# EAGLE design Schematic (EAGLE 9.6.2)
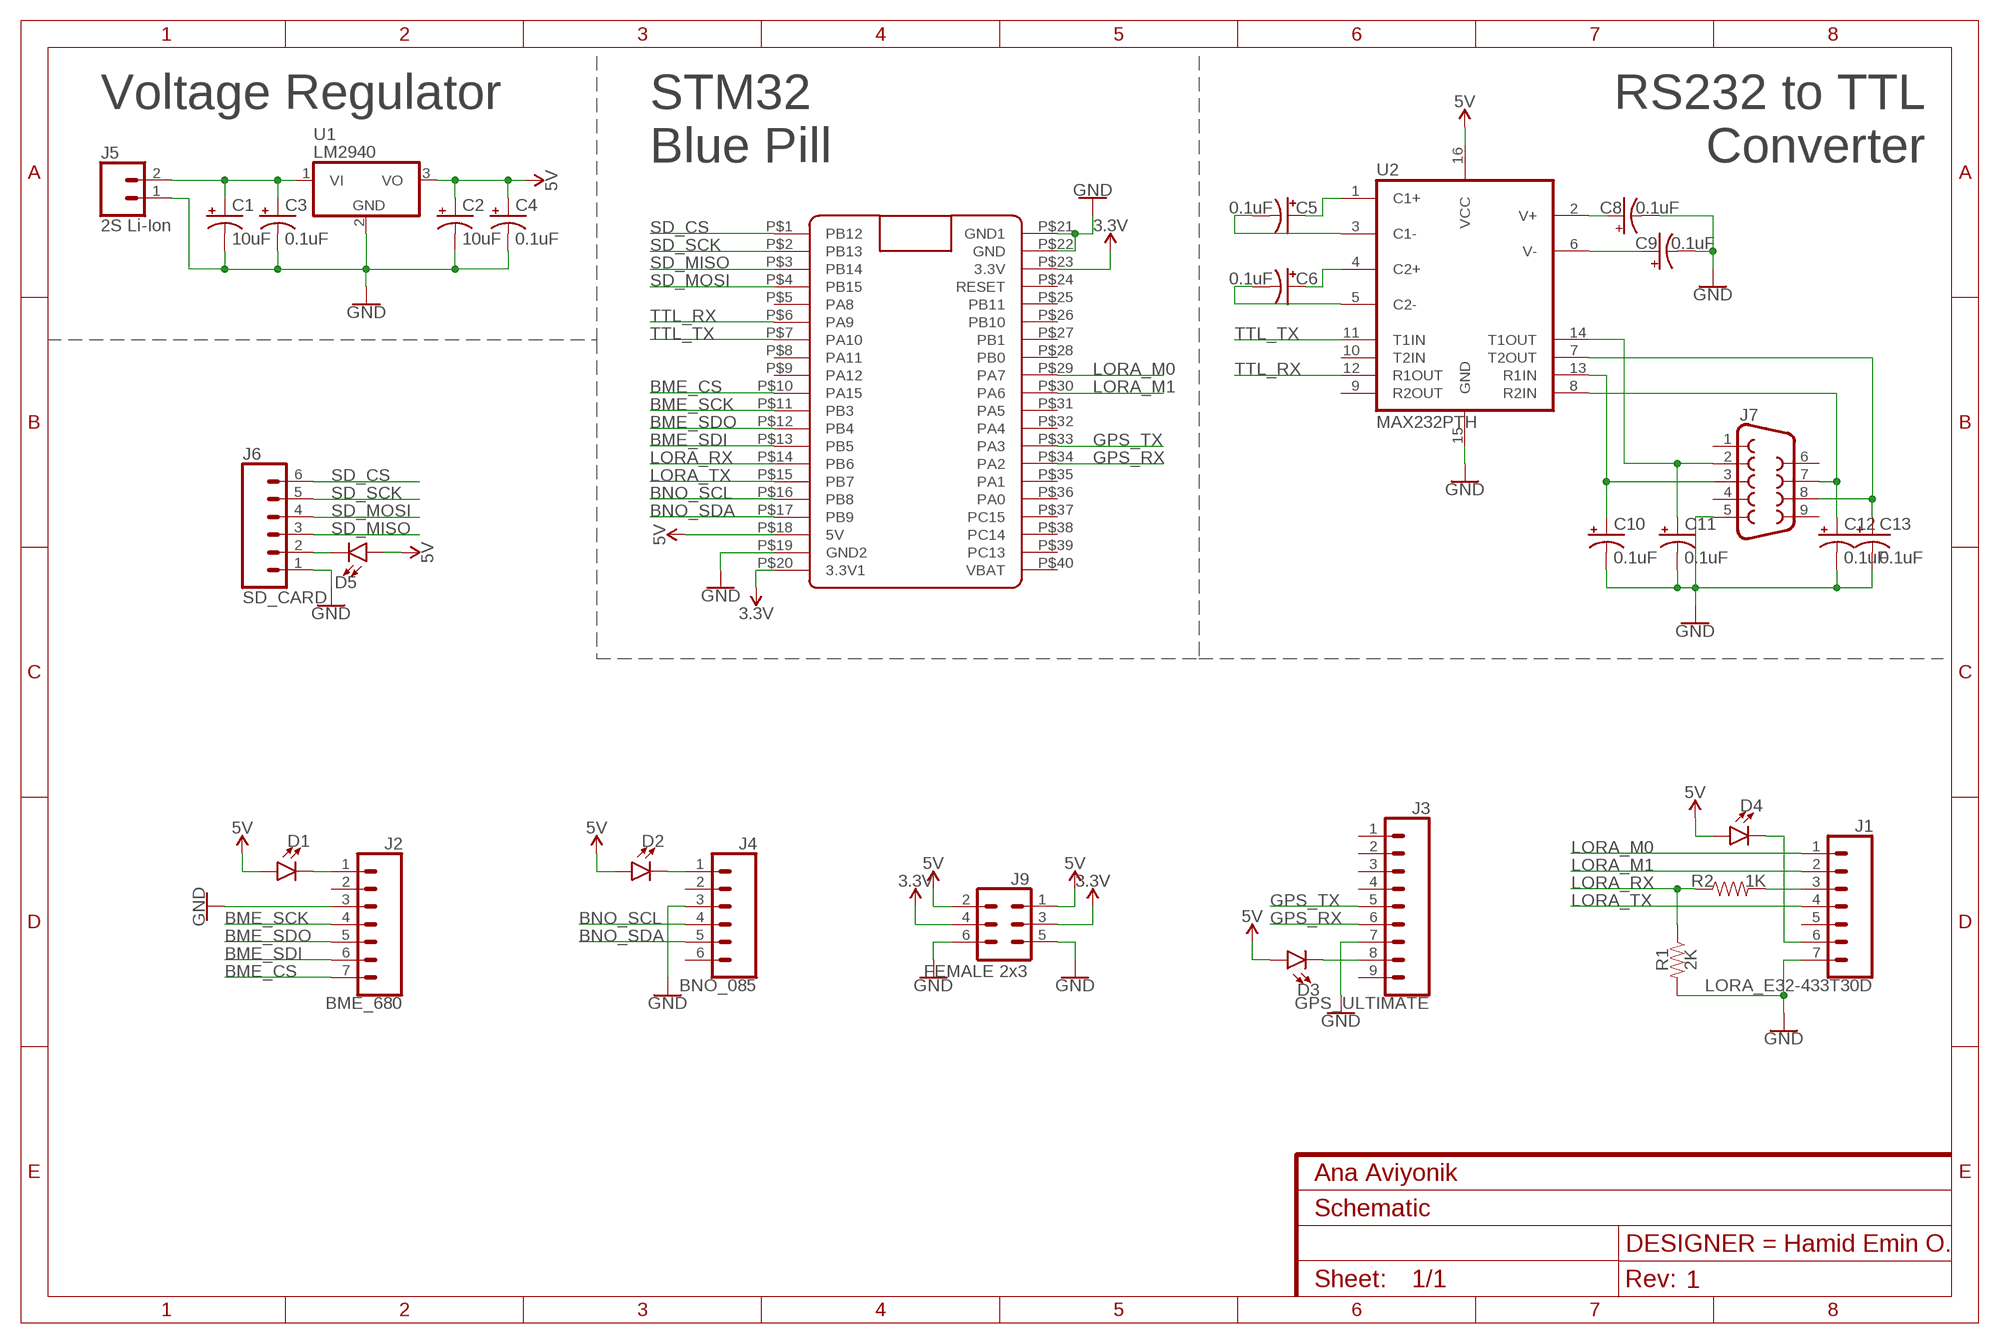
[diagram p0: schematic, sheet 1]
FRAME1 (FRAME-A4L): CNAME: Ana Aviyonik; CREVISION: 1; DESIGNER: Hamid Emin O.

## Parts
C1  10uF  10UF-POLAR-RADIAL-2.5MM-KIT-25V-20%  [CPOL-RADIAL-2.5MM-5MM-KIT]
C2  10uF  10UF-POLAR-RADIAL-2.5MM-KIT-25V-20%  [CPOL-RADIAL-2.5MM-5MM-KIT]
C3  0.1uF  10UF-POLAR-RADIAL-2.5MM-KIT-25V-20%  [CPOL-RADIAL-2.5MM-5MM-KIT]
C4  0.1uF  10UF-POLAR-RADIAL-2.5MM-KIT-25V-20%  [CPOL-RADIAL-2.5MM-5MM-KIT]
C5  0.1uF  10UF-POLAR-RADIAL-2.5MM-KIT-25V-20%  [CPOL-RADIAL-2.5MM-5MM-KIT]
C6  0.1uF  10UF-POLAR-RADIAL-2.5MM-KIT-25V-20%  [CPOL-RADIAL-2.5MM-5MM-KIT]
C8  0.1uF  10UF-POLAR-RADIAL-2.5MM-KIT-25V-20%  [CPOL-RADIAL-2.5MM-5MM-KIT]
C9  0.1uF  10UF-POLAR-RADIAL-2.5MM-KIT-25V-20%  [CPOL-RADIAL-2.5MM-5MM-KIT]
C10  0.1uF  10UF-POLAR-RADIAL-2.5MM-KIT-25V-20%  [CPOL-RADIAL-2.5MM-5MM-KIT]
C11  0.1uF  10UF-POLAR-RADIAL-2.5MM-KIT-25V-20%  [CPOL-RADIAL-2.5MM-5MM-KIT]
C12  0.1uF  10UF-POLAR-RADIAL-2.5MM-KIT-25V-20%  [CPOL-RADIAL-2.5MM-5MM-KIT]
C13  0.1uF  10UF-POLAR-RADIAL-2.5MM-KIT-25V-20%  [CPOL-RADIAL-2.5MM-5MM-KIT]
D1  LED-3MM-NO_SILK  [LED_3MM-NS]
D2  LED-3MM-NO_SILK  [LED_3MM-NS]
D3  LED-3MM-NO_SILK  [LED_3MM-NS]
D4  LED-3MM-NO_SILK  [LED_3MM-NS]
D5  LED-3MM-NO_SILK  [LED_3MM-NS]
J1  LORA_E32-433T30D  CONN_07  [1X07]
J2  BME_680  CONN_07  [1X07]
J3  GPS_ULTIMATE  CONN_09  [1X09]
J4  BNO_085  CONN_06SILK_FEMALE_PTH  [1X06]
J5  2S Li-Ion  CONN_02  [1X02]
J6  SD_CARD  CONN_06SILK_FEMALE_PTH  [1X06]
J7  DB9FEMALE  [DB9]
J9  FEMALE 2x3  CONN_03X2FEMALE  [2X3]
R1  2K  1KOHM-VERT_KIT-1/4W-5%  [AXIAL-0.1-KIT]
R2  1K  1KOHM-VERT_KIT-1/4W-5%  [AXIAL-0.1-KIT]
STM32BLUEPILL  STM32 Blue Pill  BLUE_PILL  [BLUE_PILL]
U1  LM2940  786TV  [TO220V]
U2  MAX232PTH  [DIL16]

## Nets
3.3V: J9.3 J9.4 STM32BLUEPILL.P$20(3.3V1) STM32BLUEPILL.P$23(3.3V)
5V: C2.1(+) C4.1(+) D1.A D2.A D3.A D4.A D5.A J9.1 J9.2 STM32BLUEPILL.P$18(5V) U1.3(VO) U2.16(VCC)
BME_CS: J2.7 STM32BLUEPILL.P$10(PA15)
BME_SCK: J2.4 STM32BLUEPILL.P$11(PB3)
BME_SDI: J2.6 STM32BLUEPILL.P$13(PB5)
BME_SDO: J2.5 STM32BLUEPILL.P$12(PB4)
BNO_SCL: J4.4 STM32BLUEPILL.P$16(PB8)
BNO_SDA: J4.5 STM32BLUEPILL.P$17(PB9)
GND: C1.2(-) C2.2(-) C3.2(-) C4.2(-) C8.2(-) C9.2(-) C10.2(-) C11.2(-) C12.2(-) C13.2(-) J1.7 J2.3 J3.7 J4.3 J5.1 J6.1 J7.5 J9.5 J9.6 R1.P$2 STM32BLUEPILL.P$19(GND2) STM32BLUEPILL.P$21(GND1) STM32BLUEPILL.P$22(GND) U1.2(GND) U2.15(GND)
GPS_RX: J3.6 STM32BLUEPILL.P$34(PA2)
GPS_TX: J3.5 STM32BLUEPILL.P$33(PA3)
LORA_M0: J1.1 STM32BLUEPILL.P$29(PA7)
LORA_M1: J1.2 STM32BLUEPILL.P$30(PA6)
LORA_RX: R1.P$1 R2.P$1 STM32BLUEPILL.P$14(PB6)
LORA_TX: J1.4 STM32BLUEPILL.P$15(PB7)
N$1: C1.1(+) C3.1(+) J5.2 U1.1(VI)
N$2: C8.1(+) U2.2(V+)
N$3: C9.1(+) U2.6(V-)
N$4: J1.3 R2.P$2
N$5: D1.K(C) J2.1
N$6: D2.K(C) J4.1
N$7: D3.K(C) J3.8
N$8: C6.1(+) U2.4(C2+)
N$9: C6.2(-) U2.5(C2-)
N$10: C5.1(+) U2.1(C1+)
N$11: C5.2(-) U2.3(C1-)
N$12: D4.K(C) J1.6
N$13: C13.1(+) J7.8 U2.7(T2OUT)
N$14: C12.1(+) J7.7 U2.8(R2IN)
N$15: C11.1(+) J7.2 U2.14(T1OUT)
N$16: C10.1(+) J7.3 U2.13(R1IN)
N$18: D5.K(C) J6.2
SD_CS: J6.6 STM32BLUEPILL.P$1(PB12)
SD_MISO: J6.3 STM32BLUEPILL.P$3(PB14)
SD_MOSI: J6.4 STM32BLUEPILL.P$4(PB15)
SD_SCK: J6.5 STM32BLUEPILL.P$2(PB13)
TTL_RX: STM32BLUEPILL.P$6(PA9) U2.12(R1OUT)
TTL_TX: STM32BLUEPILL.P$7(PA10) U2.11(T1IN)
Unconnected: J1.5 J2.2 J3.1 J3.2 J3.3 J3.4 J3.9 J4.2 J4.6 J7.1 J7.4 J7.6 J7.9 STM32BLUEPILL.P$5(PA8) STM32BLUEPILL.P$8(PA11) STM32BLUEPILL.P$9(PA12) STM32BLUEPILL.P$24(RESET) STM32BLUEPILL.P$25(PB11) STM32BLUEPILL.P$26(PB10) STM32BLUEPILL.P$27(PB1) STM32BLUEPILL.P$28(PB0) STM32BLUEPILL.P$31(PA5) STM32BLUEPILL.P$32(PA4) STM32BLUEPILL.P$35(PA1) STM32BLUEPILL.P$36(PA0) STM32BLUEPILL.P$37(PC15) STM32BLUEPILL.P$38(PC14) STM32BLUEPILL.P$39(PC13) STM32BLUEPILL.P$40(VBAT) U2.9(R2OUT) U2.10(T2IN)

## Notes on the sheet
- RS232 to TTL
  Converter
- Voltage Regulator
- STM32
  Blue Pill

## Library data of the parts
C1 C2 = SparkFun-Capacitors:10UF-POLAR: 10.0µF polarized capacitors A capacitor is a passive two-terminal electrical component used to store electrical energy temporarily in an electric field.; PROD_ID: CAP-08440
C3-C6 C8-C13 = SparkFun-Capacitors:10UF-POLAR: 10.0µF polarized capacitors A capacitor is a passive two-terminal electrical component used to store electrical energy temporarily in an electric field.; PROD_ID: CAP-08440; VALUE: 10uF
D1-D5 = SparkFun-LED:LED: LED (Generic) Standard schematic elements and footprints for 5mm, 3mm, 1206, and 0603 sized LEDs. Generic LEDs with no color specified.
J1 J2 = SparkFun-Connectors:CONN_07: Multi connection point. Often used as Generic Header-pin footprint for 0.1 inch spaced/style header connections On any of the 0.1 inch spaced packages, you can populate with these: Break Away Headers - Straight <https://www.sparkfun.com/products/116> (PRT-00116) Break Away Male Headers - Right Angle <https://www.sparkfun.com/products/553> (PRT-00553) Female Headers <https://www.sparkfun.com/products/115> (PRT-00115) Break Away Headers - Machine Pin <https://www.sparkfun.com/products/117> (PRT-00117) Break Away Female Headers - Swiss Machine Pin <https://www.sparkfun.com/products/743> (PRT-00743) For SCREWTERMINALS and SPRING TERMINALS visit here: Screw Terimnals on SparkFun.com <https://www.sparkfun.com/search/results?term=Screw+Terminals> (5mm/3.5mm/2.54mm spacing) This device is also useful as a general connection point to wire up your design to another part of your project. Our various solder wires solder well into these plated through hole pads. Hook-Up Wire - Assortment (Stranded, 22 AWG) <https://www.sparkfun.com/products/11375> (PRT-11375) Hook-Up Wire - Assortment (Solid Core, 22 AWG) <https://www.sparkfun.com/products/11367> (PRT-11367) View the entire wire category on our website here <https://www.sparkfun.com/categories/141> Special notes: Molex polarized connector foot print use with SKU : PRT-08231 with associated crimp pins and housings. 1MM SMD Version SKU: PRT-10208 NOTES ON THE VARIANTS LOCK and LOCK_LONGPADS... This footprint was designed to help hold the alignment of a through-hole component (i.e. 6-pin header) while soldering it into place. You may notice that each hole has been shifted either up or down by 0.005 of an inch from it's more standard position (which is a perfectly straight line). This slight alteration caused the pins (the squares in the middle) to touch the edges of the holes. Because they are alternating, it causes a "brace" to hold the component in place. 0.005 has proven to be the perfect amount of "off-center" position when using our standard breakaway headers. Although looks a little odd when you look at the bare footprint, once you have a header in there, the alteration is very hard to notice. Also,if you push a header all the way into place, it is covered up entirely on the bottom side.
J3 = SparkFun-Connectors:CONN_09: Multi connection point. Often used as Generic Header-pin footprint for 0.1 inch spaced/style header connections On any of the 0.1 inch spaced packages, you can populate with these: Break Away Headers - Straight <https://www.sparkfun.com/products/116> (PRT-00116) Break Away Male Headers - Right Angle <https://www.sparkfun.com/products/553> (PRT-00553) Female Headers <https://www.sparkfun.com/products/115> (PRT-00115) Break Away Headers - Machine Pin <https://www.sparkfun.com/products/117> (PRT-00117) Break Away Female Headers - Swiss Machine Pin <https://www.sparkfun.com/products/743> (PRT-00743) For SCREWTERMINALS and SPRING TERMINALS visit here: Screw Terimnals on SparkFun.com <https://www.sparkfun.com/search/results?term=Screw+Terminals> (5mm/3.5mm/2.54mm spacing) This device is also useful as a general connection point to wire up your design to another part of your project. Our various solder wires solder well into these plated through hole pads. Hook-Up Wire - Assortment (Stranded, 22 AWG) <https://www.sparkfun.com/products/11375> (PRT-11375) Hook-Up Wire - Assortment (Solid Core, 22 AWG) <https://www.sparkfun.com/products/11367> (PRT-11367) View the entire wire category on our website here <https://www.sparkfun.com/categories/141> Special notes: Molex polarized connector foot print use with SKU : PRT-08231 with associated crimp pins and housings. 1MM SMD Version SKU: PRT-10208 NOTES ON THE VARIANTS LOCK and LOCK_LONGPADS... This footprint was designed to help hold the alignment of a through-hole component (i.e. 6-pin header) while soldering it into place. You may notice that each hole has been shifted either up or down by 0.005 of an inch from it's more standard position (which is a perfectly straight line). This slight alteration caused the pins (the squares in the middle) to touch the edges of the holes. Because they are alternating, it causes a "brace" to hold the component in place. 0.005 has proven to be the perfect amount of "off-center" position when using our standard breakaway headers. Although looks a little odd when you look at the bare footprint, once you have a header in there, the alteration is very hard to notice. Also,if you push a header all the way into place, it is covered up entirely on the bottom side.
J4 J6 = SparkFun-Connectors:CONN_06: Multi connection point. Often used as Generic Header-pin footprint for 0.1 inch spaced/style header connections On any of the 0.1 inch spaced packages, you can populate with these: Break Away Headers - Straight <https://www.sparkfun.com/products/116> (PRT-00116) Break Away Male Headers - Right Angle <https://www.sparkfun.com/products/553> (PRT-00553) Female Headers <https://www.sparkfun.com/products/115> (PRT-00115) Break Away Headers - Machine Pin <https://www.sparkfun.com/products/117> (PRT-00117) Break Away Female Headers - Swiss Machine Pin <https://www.sparkfun.com/products/743> (PRT-00743) Arduino Stackable Header - 6 Pin <https://www.sparkfun.com/products/9280> (PRT-09280) Screw Terminals 2.54mm Pitch (6-Pin) <https://www.sparkfun.com/products/16499> (PRT-16499) For SCREWTERMINALS and SPRING TERMINALS visit here: Screw Terimnals on SparkFun.com <https://www.sparkfun.com/search/results?term=Screw+Terminals> (5mm/3.5mm/2.54mm spacing) This device is also useful as a general connection point to wire up your design to another part of your project. Our various solder wires solder well into these plated through hole pads. Hook-Up Wire - Assortment (Stranded, 22 AWG) <https://www.sparkfun.com/products/11375> (PRT-11375) Hook-Up Wire - Assortment (Solid Core, 22 AWG) <https://www.sparkfun.com/products/11367> (PRT-11367) View the entire wire category on our website here <https://www.sparkfun.com/categories/141>; PROD_ID: CONN-08437
J5 = SparkFun-Connectors:CONN_02: Multi connection point. Often used as Generic Header-pin footprint for 0.1 inch spaced/style header connections On any of the 0.1 inch spaced packages, you can populate with these: Break Away Headers - Straight <https://www.sparkfun.com/products/116> (PRT-00116) Break Away Male Headers - Right Angle <https://www.sparkfun.com/products/553> (PRT-00553) Female Headers <https://www.sparkfun.com/products/115> (PRT-00115) Break Away Headers - Machine Pin <https://www.sparkfun.com/products/117> (PRT-00117) Break Away Female Headers - Swiss Machine Pin <https://www.sparkfun.com/products/743> (PRT-00743) For SCREWTERMINALS and SPRING TERMINALS visit here: Screw Terimnals on SparkFun.com <https://www.sparkfun.com/search/results?term=Screw+Terminals> (5mm/3.5mm/2.54mm spacing) This device is also useful as a general connection point to wire up your design to another part of your project. Our various solder wires solder well into these plated through hole pads. Hook-Up Wire - Assortment (Stranded, 22 AWG) <https://www.sparkfun.com/products/11375> (PRT-11375) Hook-Up Wire - Assortment (Solid Core, 22 AWG) <https://www.sparkfun.com/products/11367> (PRT-11367) View the entire wire category on our website here <https://www.sparkfun.com/categories/141> Special notes: Molex polarized connector foot print use with: PRT-08233 with associated crimp pins and housings. 2.54_SCREWTERM for use with PRT-10571. 3.5mm Screw Terminal footprints for PRT-08084 5mm Screw Terminal footprints for use with PRT-08432
J7 = SparkFun-Connectors:DB9: DB9 Connector Standard DB9 (D-Sub 9) serial connector. Can be used for CAN bus as well as RS485 and RS232. Footprint production proven. Here is the female version connector we sell at SparkFun: 9 Pin Female Serial Connector - PCB Mount <https://www.sparkfun.com/products/429> (PRT-00429) This connector has been used on the following SparkFun products: SparkFun RS232 Shifter - SMD <https://www.sparkfun.com/products/449> (PRT-00449) SparkFun RS232 Shifter SMD (No DB9) <https://www.sparkfun.com/products/8780> (PRT-08780); PROD_ID: CONN-08194
J9 = SparkFun-Connectors:CONN_03X2: Multi connection point. Often used as Generic Header-pin footprint for 0.1 inch spaced/style header connections You can populate with any combo of single row headers, but if you'd like an exact match, check these: Header - 2x3 (Male, 0.1") <https://www.sparkfun.com/products/12807> (PRT-12807) Header - 2x3 (Female, 0.1") <https://www.sparkfun.com/products/13010> (PRT-13010) 2x3 Pin Shrouded Header <https://www.sparkfun.com/products/10877> (PRT-10877) On any of the 0.1 inch spaced packages, you can populate with these: Break Away Headers - Straight <https://www.sparkfun.com/products/116> (PRT-00116) Break Away Male Headers - Right Angle <https://www.sparkfun.com/products/553> (PRT-00553) Female Headers <https://www.sparkfun.com/products/115> (PRT-00115) Break Away Headers - Machine Pin <https://www.sparkfun.com/products/117> (PRT-00117) Break Away Female Headers - Swiss Machine Pin <https://www.sparkfun.com/products/743> (PRT-00743) Special note: the shrouded connector mates well with our 3x2 ribbon cables: Ribbon Crimp Connector - 6-pin (2x3, Female) <https://www.sparkfun.com/products/10651> (PRT-10651) Ribbon Cable - 6 wire (15ft) <https://www.sparkfun.com/products/10646> (PRT-10646); PROD_ID: CONN-11566
R1 R2 = SparkFun-Resistors:1KOHM: 1kΩ resistor A resistor is a passive two-terminal electrical component that implements electrical resistance as a circuit element. Resistors act to reduce current flow, and, at the same time, act to lower voltage levels within circuits. - Wikipedia; PROD_ID: RES-08380; VALUE: 1k
STM32BLUEPILL = BluePill:BLUE_PILL
U1 = linear:78*: Positive VOLTAGE REGULATOR Source: http://cache.national.com/ds/LM/LM78L05.pdf http://www.fairchildsemi.com/ds/LM/LM7805.pdf
U2 = MAXIM:MAX232: RS232 Transceiver Very common IC. This is generically called 'MAX232', but works with the 3V equivalent MAX3232 generic ICs. Field tested and mother approved. Spark Fun Electronics SKU : COM-00316 (DIP) and COM-00589 (SMD)

## Board
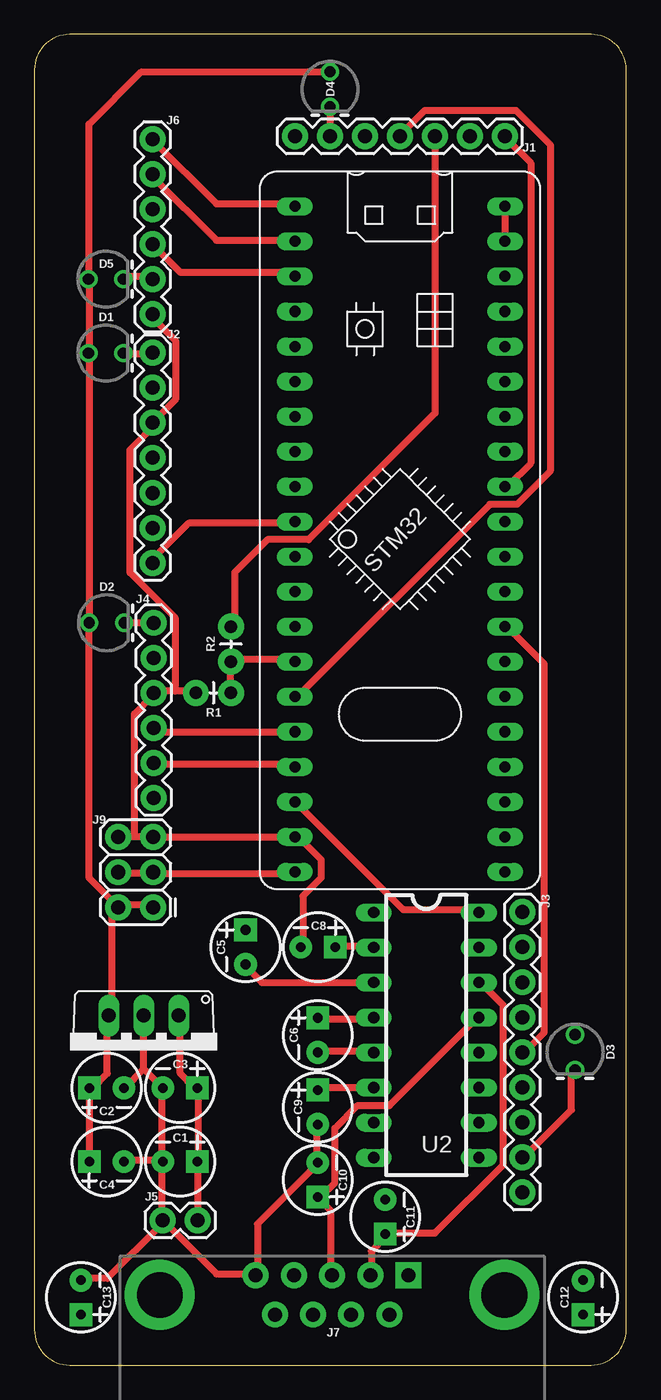
[diagram p1: board, top side]
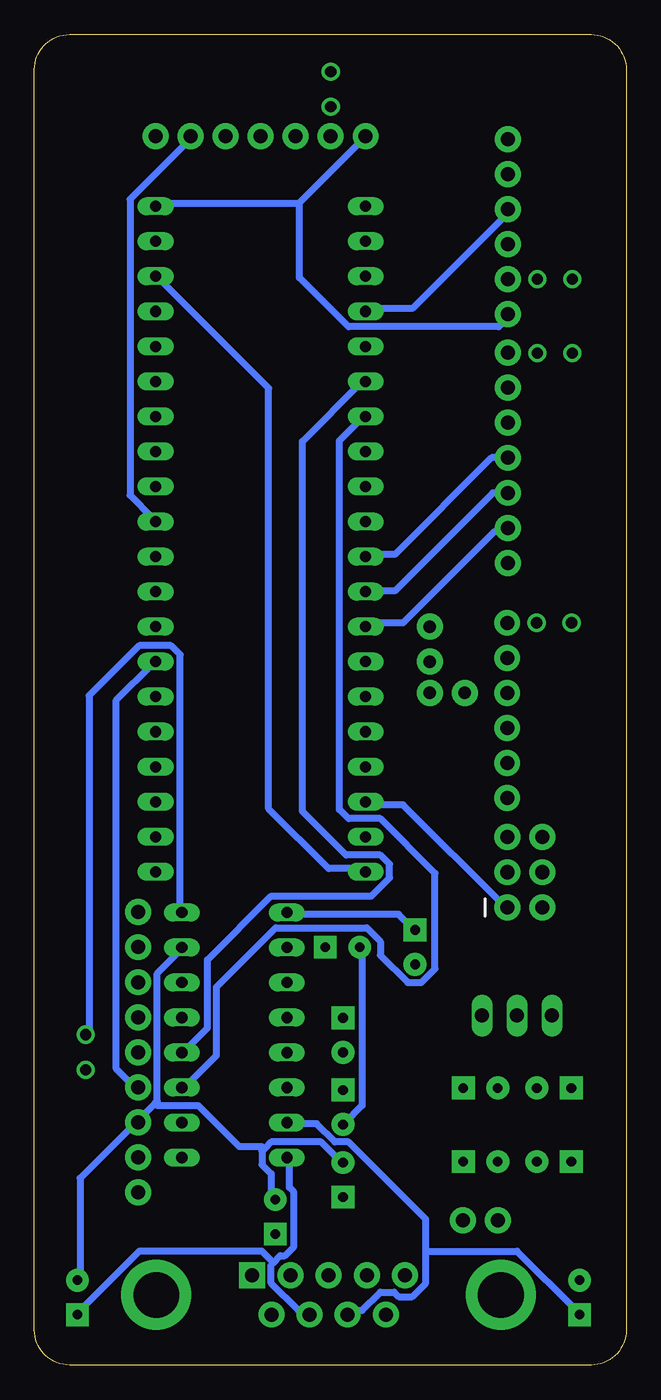
[diagram p2: board, bottom side, seen from below]

Size 42.93 x 96.48 mm. Coordinates in mm from the lower left corner, seen from the top.
Outline: 0,93.94 0,2.54 arc90 2.54,0 40.39,0 arc90 42.93,2.54 42.93,93.94 arc90 40.39,96.48 2.54,96.48 arc90 0,93.94
Copper layers (1*16): Top 0.035mm / dielectric 1.5mm / Bottom 0.035mm
Design rules "default *": minimum track width 20mil, minimum drill 0.35mm, track to track 6mil, track to pad 6mil, pad to pad 6mil, via to via 6mil, smd to smd 6mil, copper to edge 40mil, drill to drill 6mil, minimum pad ring 10mil, minimum via ring 8mil, stop-mask expansion 4mil, vias tented up to drill 0mil, thermal gap 10mil

### Footprints (pad centres in the part's own frame; a part is rotated, then mirrored left to right if it is on the bottom)
CPOL-RADIAL-2.5MM-5MM-KIT = drill 0.7 pad 1.651 square: 1 1.25,0 | drill 0.7 pad 1.651: 2 -1.25,0
LED_3MM-NS = drill 0.813: A -1.27,0; K 1.27,0
1X07 = drill 1.016 pad 1.88: 1 0,0; 2 2.54,0; 3 5.08,0; 4 7.62,0; 5 10.16,0; 6 12.7,0; 7 15.24,0
1X09 = drill 1.016 pad 1.88: 1 0,0; 2 2.54,0; 3 5.08,0; 4 7.62,0; 5 10.16,0; 6 12.7,0; 7 15.24,0; 8 17.78,0; 9 20.32,0
1X06 = drill 1.016 pad 1.88: 1 0,0; 2 2.54,0; 3 5.08,0; 4 7.62,0; 5 10.16,0; 6 12.7,0
1X02 = drill 1.016 pad 1.88: 1 0,0; 2 2.54,0
DB9 = drill 1.016 pad 1.88 square: 1 -5.54,-1.42 | drill 1.016 pad 1.88: 2 -2.77,-1.42; 3 0,-1.42; 4 2.77,-1.42; 5 5.54,-1.42; 6 -4.15,1.42; 7 -1.38,1.42; 8 1.38,1.42; 9 4.15,1.42 | drill 3.302 pad 5.08: G1 -12.5,0; G2 12.5,0
2X3 = drill 1.016 pad 1.88: 1 0,0; 2 0,2.54; 3 2.54,0; 4 2.54,2.54; 5 5.08,0; 6 5.08,2.54
AXIAL-0.1-KIT = drill 0.9 pad 1.88: P$1 -1.27,0; P$2 1.27,0
BLUE_PILL = drill 0.8 long: P$1 -7.62,15.24; P$2 -7.62,12.7; P$3 -7.62,10.16; P$4 -7.62,7.62; P$5 -7.62,5.08; P$6 -7.62,2.54; P$7 -7.62,0; P$8 -7.62,-2.54; P$9 -7.62,-5.08; P$10 -7.62,-7.62; P$11 -7.62,-10.16; P$12 -7.62,-12.7; P$13 -7.62,-15.24; P$14 -7.62,-17.78; P$15 -7.62,-20.32; P$16 -7.62,-22.86; P$17 -7.62,-25.4; P$18 -7.62,-27.94; P$19 -7.62,-30.48; P$20 -7.62,-33.02; P$21 7.62,15.24; P$22 7.62,12.7; P$23 7.62,10.16; P$24 7.62,7.62; P$25 7.62,5.08; P$26 7.62,2.54; P$27 7.62,0; P$28 7.62,-2.54; P$29 7.62,-5.08; P$30 7.62,-7.62; P$31 7.62,-10.16; P$32 7.62,-12.7; P$33 7.62,-15.24; P$34 7.62,-17.78; P$35 7.62,-20.32; P$36 7.62,-22.86; P$37 7.62,-25.4; P$38 7.62,-27.94; P$39 7.62,-30.48; P$40 7.62,-33.02
TO220V = drill 1.016 long: 1 -2.54,-2.54; 2 0,-2.54; 3 2.54,-2.54
DIL16 = drill 0.813 long: 1 -8.89,-3.81; 2 -6.35,-3.81; 3 -3.81,-3.81; 4 -1.27,-3.81; 5 1.27,-3.81; 6 3.81,-3.81; 7 6.35,-3.81; 8 8.89,-3.81; 9 8.89,3.81; 10 6.35,3.81; 11 3.81,3.81; 12 1.27,3.81; 13 -1.27,3.81; 14 -3.81,3.81; 15 -6.35,3.81; 16 -8.89,3.81

### Placement (x,y rotation side)
C1  10.57,14.76 0 top
C2  5.23,20.09 180 top
C3  10.57,20.09 0 top
C4  5.23,14.76 180 top
C5  15.32,30.3 90 top
C6  20.55,23.93 90 top
C8  20.57,30.3 0 top
C9  20.55,18.69 90 top
C10  20.55,13.44 270 top
C11  25.45,10.74 270 top
C12  39.8,4.9 270 top
C13  3.38,4.9 270 top
D1  5.18,73.38 0 top
D2  5.23,53.82 0 top
D3  39.22,22.68 270 top
D4  21.44,92.51 270 top
D5  5.18,78.74 0 top
J1  34.14,89.1 180 top
J2  8.59,73.41 270 top
J3  35.41,32.84 270 top
J4  8.64,53.82 270 top
J5  9.3,10.49 0 top
J6  8.59,76.2 90 top
J7  21.59,5.08 180 top
J9  8.61,33.2 90 top
R1  12.98,48.74 180 top
R2  14.25,52.27 90 top
STM32BLUEPILL  26.52,68.78 0 top
U1  7.92,22.81 180 top
U2  28.42,23.93 270 top

### Tracks (layer width: path | path; a pad name or v marks a point on that pad's centre or on a via)
3.3V
  Top 0.508: STM32BLUEPILL.P$20 18.82,35.66 8.91,35.66 J9.3 8.59,35.66 6.27,35.66 J9.4
  Bottom 0.508: STM32BLUEPILL.P$23 34.01,78.92 25.93,70.84 25.93,40.34 21.59,35.99 19.15,35.99 STM32BLUEPILL.P$20
5V
  Top 0.508: D4.A 7.75,93.78 3.96,89.99 3.96,78.92 D5.A 3.96,78.59 3.96,73.64 D1.A 3.96,73.3 D2.A 3.96,35.33 5.94,33.35 J9.2 | C4.1 3.96,14.86 3.96,19.81 C2.1 4.29,20.14 5.28,21.13 5.28,25.09 U1.3 5.61,25.43 5.61,32.69 5.94,33.02 J9.2 | U2.16 32.03,33.02 26.75,33.02 19.15,40.62 STM32BLUEPILL.P$18 | J9.2 6.27,33.35 8.59,33.35 J9.1
  Bottom 0.508: STM32BLUEPILL.P$18 18.82,40.62 16.18,40.62 8.91,33.35 J9.1 | D3.A 38.96,24.11 38.96,48.54 35.33,52.17 33.02,52.17 32.36,51.51 32.36,33.02 U2.16
BME_CS
  Top 0.508: STM32BLUEPILL.P$10 18.82,61.09 11.23,61.09 8.59,58.45 J2.7
BME_SCK
  Bottom 0.508: J2.4 9.78,65.79 16.79,58.78 18.82,58.78 STM32BLUEPILL.P$11
BME_SDI
  Bottom 0.508: STM32BLUEPILL.P$13 18.82,53.82 16.18,53.82 9.58,60.43 8.59,60.43 J2.6
BME_SDO
  Bottom 0.508: J2.5 9.68,63.25 16.79,56.13 18.82,56.13 STM32BLUEPILL.P$12
BNO_SCL
  Top 0.508: STM32BLUEPILL.P$16 18.82,45.9 8.91,45.9 J4.4
BNO_SDA
  Top 0.508: STM32BLUEPILL.P$17 18.82,43.59 8.91,43.59 J4.5
GND
  Top 0.508: 7.92,21.46 U1.2 | 7.92,21.46 6.6,20.14 C2.2 | 7.92,21.46 9.25,20.14 C3.2 9.25,19.81 9.25,14.86 | 9.25,14.86 6.6,14.86 C4.2 | C13.2 3.63,6.27 5.28,6.27 9.25,10.24 J5.1 | J5.1 9.58,10.24 13.21,6.6 15.85,6.6 J7.5 16.18,6.6 16.18,10.24 20.47,14.53 C10.2 20.47,14.86 20.47,17.17 C9.2 | J5.1 9.25,10.57 9.25,14.53 C1.2 9.25,14.86 | STM32BLUEPILL.P$21 STM32BLUEPILL.P$22 | J6.1 8.59,75.95 10.24,74.3 10.24,70 8.59,68.35 J2.3 8.59,68.02 6.93,66.37 6.93,57.45 10.24,54.15 10.24,48.87 | 10.24,48.87 11.56,48.87 R1.P$2 | 10.24,48.87 8.91,48.87 J4.3 8.59,48.54 7.26,47.22 7.26,38.3 | C8.2 19.48,30.38 19.48,34.01 20.8,35.33 20.8,36.65 19.15,38.3 STM32BLUEPILL.P$19 8.91,38.3 J9.5 8.59,38.3 7.26,38.3 | 7.26,38.3 6.27,38.3 J9.6
  Bottom 0.508: 26.25,15.68 25.76,16.18 22.12,16.18 20.8,14.86 C10.2 | 26.25,15.68 26.42,15.52 26.42,14.53 25.76,13.87 25.76,12.22 C11.2 | 34.18,18.99 35.33,17.83 J3.7 35.66,17.5 39.62,13.54 39.62,6.27 C12.2 | 34.18,18.99 34.01,19.15 34.01,28.4 32.36,30.05 U2.15 | 26.25,15.68 26.42,15.85 28.07,15.85 31.04,18.82 34.01,18.82 34.18,18.99 | 23.7,84.28 19.15,88.82 J1.7 | 23.7,84.28 23.77,84.2 34.01,84.2 STM32BLUEPILL.P$21 | 23.7,84.28 23.7,78.84 20.14,75.29 9.25,75.29 8.59,75.95 J6.1 | C9.2 20.47,17.5 19.15,18.82 19.15,30.05 C8.2
GPS_RX
  Bottom 0.508: STM32BLUEPILL.P$34 34.34,50.85 36.98,48.21 36.98,21.46 35.66,20.14 J3.6
GPS_TX
  Top 0.508: STM32BLUEPILL.P$33 34.34,53.49 36.98,50.85 36.98,24.11 35.66,22.78 J3.5
LORA_M0
  Top 0.508: STM32BLUEPILL.P$29 34.34,63.73 35.99,65.38 35.99,87.17 34.34,88.82 J1.1
LORA_M1
  Bottom 0.508: STM32BLUEPILL.P$30 34.34,61.42 35.99,63.07 35.99,84.53 31.7,88.82 J1.2
LORA_RX
  Top 0.508: STM32BLUEPILL.P$14 18.82,51.18 14.53,51.18 R2.P$1 14.2,50.85 14.2,48.87 R1.P$1
LORA_TX
  Top 0.508: J1.4 26.52,89.18 28.32,90.98 34.92,90.98 37.41,88.49 37.41,64.82 35,62.41 33.02,62.41 19.15,48.54 STM32BLUEPILL.P$15
N$1
  Top 0.508: J5.2 11.89,10.57 11.89,14.53 C1.1 11.89,14.86 11.89,19.81 C3.1 11.56,20.14 10.57,21.13 10.57,25.09 U1.1
N$2
  Top 0.508: U2.2 24.43,30.38 22.12,30.38 C8.1
N$3
  Top 0.508: U2.6 24.43,20.14 20.8,20.14 C9.1
N$4
  Top 0.508: J1.3 29.06,69.01 19.89,59.84 16.89,59.84 14.53,57.48 14.53,53.82 R2.P$2
N$5
  Top 0.508: D1.K 6.6,73.3 8.59,73.3 J2.1
N$6
  Top 0.508: J4.1 D2.K
N$7
  Top 0.508: D3.K 38.96,21.13 38.96,18.49 35.66,15.19 J3.8
N$8
  Top 0.508: U2.4 24.43,25.09 20.8,25.09 C6.1
N$9
  Top 0.508: U2.5 24.43,22.78 20.8,22.78 C6.2
N$10
  Bottom 0.508: U2.1 24.43,32.69 16.51,32.69 15.52,31.7 C5.1
N$11
  Top 0.508: U2.3 16.51,27.74 15.52,28.73 C5.2
N$12
  Top 0.508: D4.K 21.46,91.14 21.46,89.15 J1.6
N$13
  Bottom 0.508: 14.53,8.26 14.53,5.94 15.52,4.95 16.51,4.95 16.84,5.28 17.83,5.28 19.15,3.96 20.14,3.96 J7.8 | 14.53,8.26 14.53,10.57 20.14,16.18 21.13,16.18 22.45,17.5 24.43,17.5 U2.7 | 14.53,8.26 7.92,8.26 3.63,3.96 C13.1
N$14
  Bottom 0.508: 25.59,7.43 25.76,7.26 25.76,5.94 23.77,3.96 23.11,3.96 J7.7 | 25.59,7.43 25.09,7.92 24.77,7.92 24.11,8.59 24.11,12.55 24.43,12.88 24.43,14.86 U2.8 | 25.59,7.43 26.42,8.26 35.33,8.26 39.62,3.96 C12.1
N$15
  Top 0.508: U2.14 32.36,27.74 34.01,26.09 34.01,14.53 29.06,9.58 25.76,9.58 C11.1 25.43,9.25 24.43,8.26 24.43,6.6 J7.2
N$16
  Top 0.508: U2.13 32.03,25.09 25.76,18.82 23.44,18.82 21.79,17.17 21.79,13.21 20.8,12.22 C10.1 20.8,11.89 21.46,11.23 21.46,6.6 J7.3
N$18
  Top 0.508: D5.K 6.6,78.92 8.59,78.92 J6.2
SD_CS
  Top 0.508: STM32BLUEPILL.P$1 18.82,84.2 13.21,84.2 8.59,88.82 J6.6
SD_MISO
  Top 0.508: STM32BLUEPILL.P$3 18.82,79.25 10.57,79.25 8.59,81.23 J6.3
SD_MOSI
  Bottom 0.508: STM32BLUEPILL.P$4 18.82,76.61 15.52,76.61 8.59,83.54 J6.4
SD_SCK
  Top 0.508: STM32BLUEPILL.P$2 18.82,81.56 13.21,81.56 8.59,86.18 J6.5
TTL_RX
  Bottom 0.508: STM32BLUEPILL.P$6 19.15,71.32 23.5,66.98 23.5,40.16 20.32,36.98 17.83,36.98 17.17,36.32 17.17,35.33 18.49,34.01 25.76,34.01 30.38,29.39 30.38,24.43 32.03,22.78 U2.12
TTL_TX
  Bottom 0.508: STM32BLUEPILL.P$7 19.15,68.68 20.8,67.03 20.8,40.28 20.14,39.62 17.83,39.62 13.87,35.66 13.87,28.73 14.86,27.74 15.85,27.74 17.83,29.72 17.83,30.71 18.82,31.7 25.43,31.7 29.72,27.41 29.72,22.45 32.03,20.14 U2.11